# Altium schematic sheet main_5.SchDoc: main
size 282 x 200 mm; Date: 9/25/2019 7:26:14 PM; SheetNumber: 6; CNAME: RJ Cunningham; GateName_1: G$1; SymbolName_1: A4L-LOC; LibraryName: frames; DeviceSetName: A4L-LOC
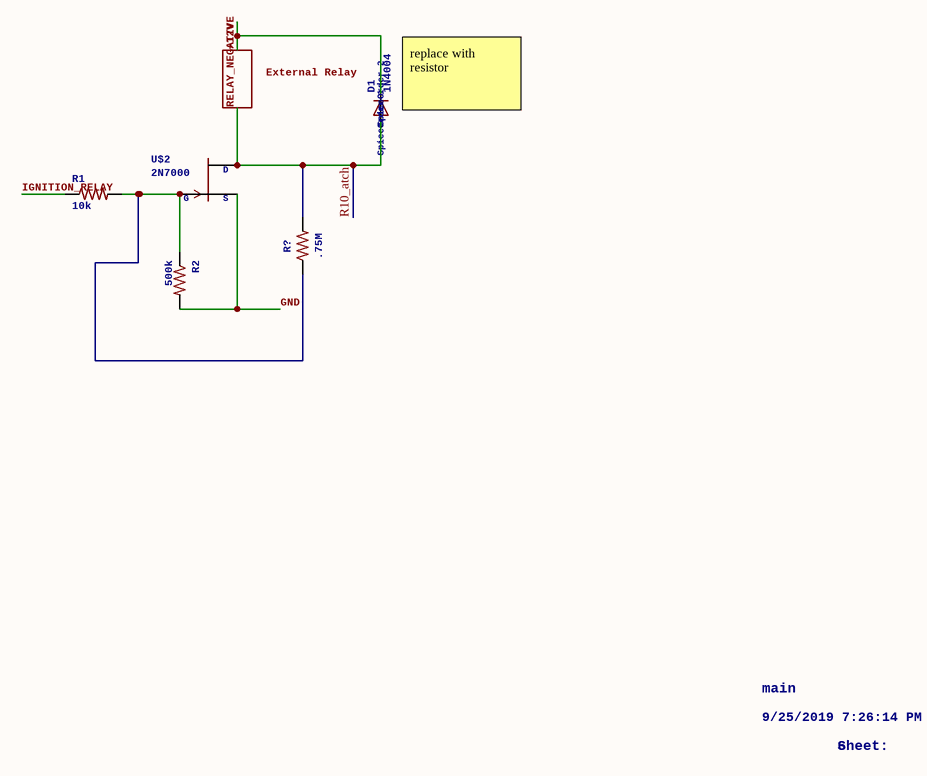
[diagram p0: main_5.SchDoc]

## Parts
D1  1N4004  SpiceOrder1: SpiceOrder 1  SpiceOrder2: SpiceOrder 2  [DO41-10]
R1  10k  [R0805]
R2  500k  [R0805]
R?  .75M  [0402]
U$2  2N7000  [SOT23]

## Nets
+12V: D1.C
GND: R2.2 U$2.2(S)
IGNITION_RELAY: R1.1
R10_atch: D1.A R?.2 U$2.3(D)  [also labelled RELAY_NEGATIVE]
NetR1_2: R1.2 R2.1 R?.1 U$2.1(G)

## Notes on the sheet
- (near D1) External Relay
- (near D1) replace with resistor
- main
- 9/25/2019 7:26:14 PM
- 6
- Sheet:
- 1
- 2
- 3
- 4
- 5
- A
- B
- C
- D

## Library data of the parts
D1 = 1N4004: DIODEgeneral purpose rectifier, 1 A; GateName_1: 1; SymbolName_1: D; LibraryName: diode; DeviceSetName: 1N4004
R1 R2 = R-US_R0805: RESISTOR, American symbol; GateName_1: G$1; SymbolName_1: R-US; DeviceSetName: R-US_; DeviceName: R0805; LibraryName: rcl
R? = RESISTOR0402: value gotten from measurement after luna damage; GateName_1: G$1; SymbolName_1: RESISTOR; DeviceName: 0402; LibraryName: Big Red Library; DeviceSetName: RESISTOR; Package: 0402
U$2 = 2N7000: GateName_1: G$1; SymbolName_1: JFET-N; LibraryName: transistor-fet-extra; DeviceSetName: 2N7000; D: D; S: S; G: G